# EAGLE design Drl_NEW (EAGLE 8.2.2)
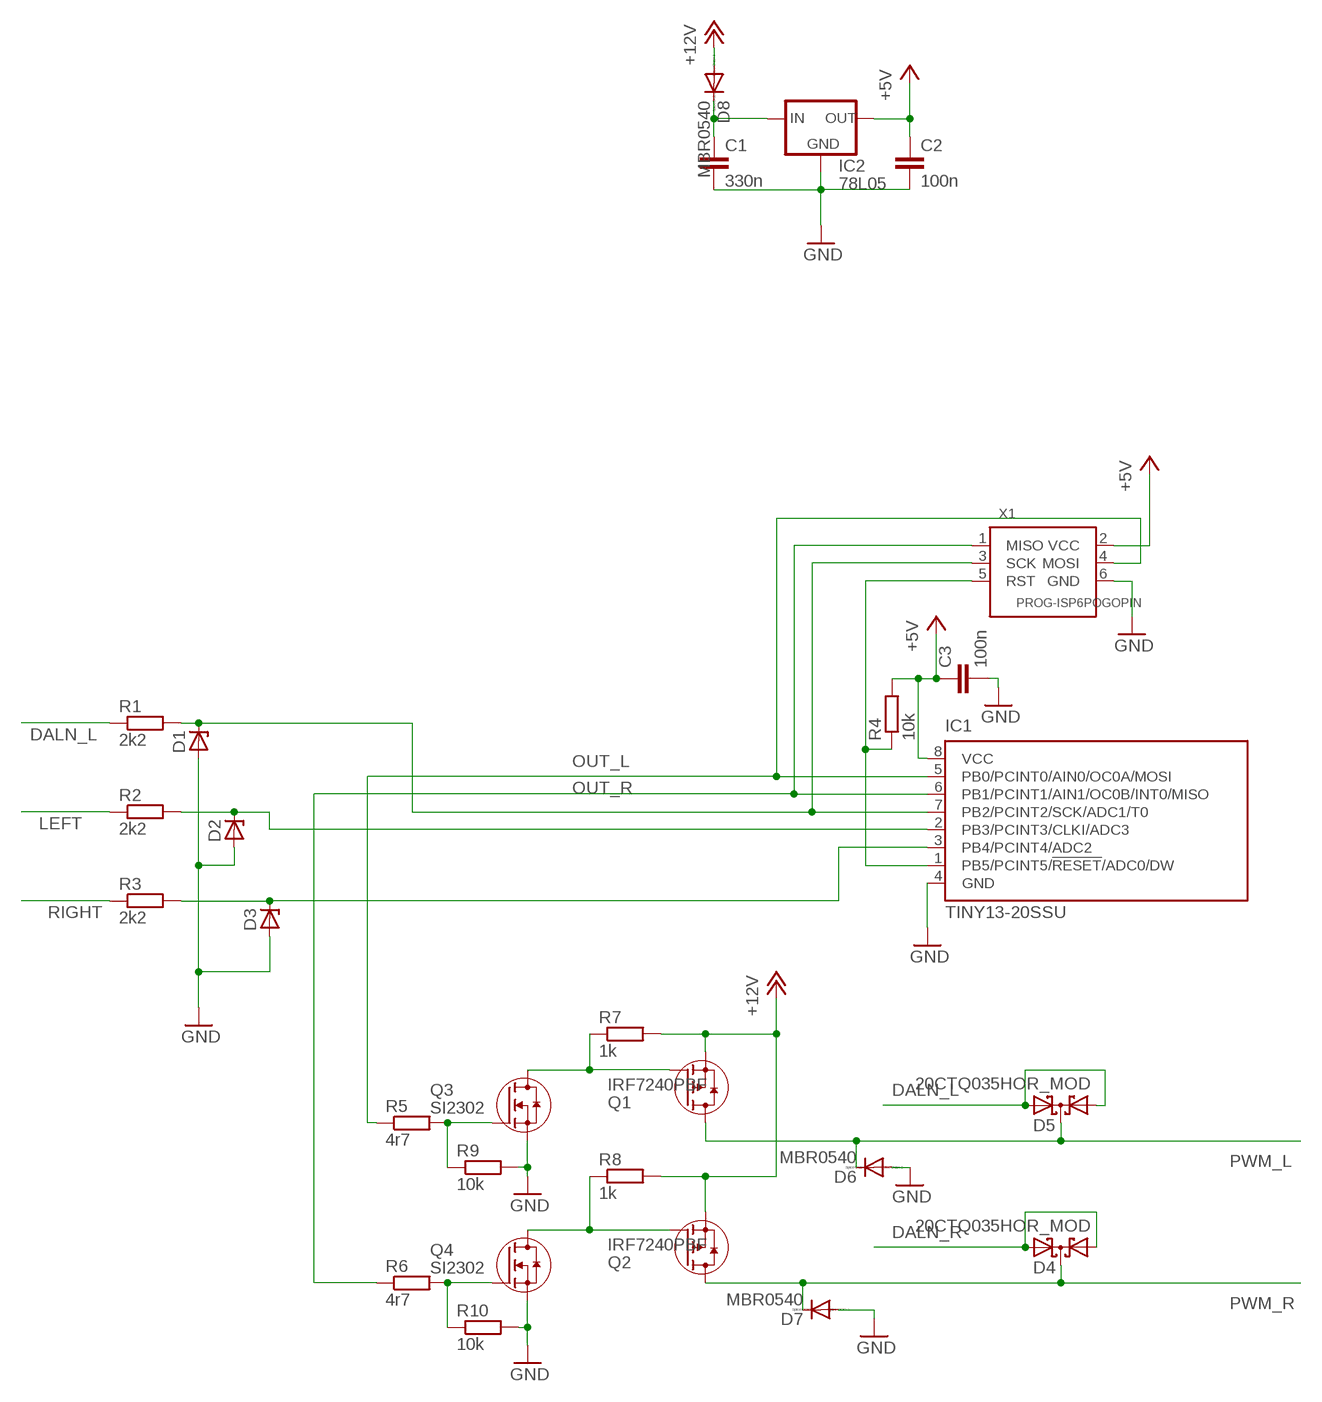
[diagram p0: schematic, sheet 1]

## Parts
C1  330n  C-EUC0805  [C0805]
C2  100n  C-EUC0805  [C0805]
C3  100n  C-EUC0805  [C0805]
D1  ZENER-DIODESOD80C  [SOD80C]
D2  ZENER-DIODESOD80C  [SOD80C]
D3  ZENER-DIODESOD80C  [SOD80C]
D4  20CTQ035HOR_MOD  [TO220AB_MOD]
D5  20CTQ035HOR_MOD  [TO220AB_MOD]
D6  MBR0540  CGRM4001-G  [SOD-123_MINI-SMA]
D7  MBR0540  CGRM4001-G  [SOD-123_MINI-SMA]
D8  MBR0540  CGRM4001-G  [SOD-123_MINI-SMA]
IC1  TINY13-20SSU  [8S1]
IC2  78L05  78LXXSOT89  [78LXX-SOT89]
Q1  IRF7240PBF  [SO08]
Q2  IRF7240PBF  [SO08]
Q3  SI2302  [SOT-23-GSD]
Q4  SI2302  [SOT-23-GSD]
R1  2k2  R-EU_R0603  [R0603]
R2  2k2  R-EU_R0603  [R0603]
R3  2k2  R-EU_R0603  [R0603]
R4  10k  R-EU_R0603  [R0603]
R5  4r7  R-EU_R0603  [R0603]
R6  4r7  R-EU_R0603  [R0603]
R7  1k  R-EU_R0603  [R0603]
R8  1k  R-EU_R0603  [R0603]
R9  10k  R-EU_R0603  [R0603]
R10  10k  R-EU_R0603  [R0603]
X1  PROG-ISP6POGOPIN  [PROG_POGOPIN]

## Nets
+5V: C2.1 C3.1 IC1.8(VCC) IC2.OUT R4.2 X1.2(VCC)
+12V: D8.A Q1.1(S) Q1.2(S) Q1.3(S) Q2.1(S) Q2.2(S) Q2.3(S) R7.2 R8.2
DALN_L: D5.A1 D5.A2 R1.1
DALN_R: D4.A1 D4.A2
GND: C1.2 C2.2 C3.2 D1.A D2.A D3.A D6.A D7.A IC1.4(GND) IC2.GND@0(GND) IC2.GND@1(GND) Q3.S Q4.S R9.2 R10.2 X1.6(GND)
LEFT: R2.1
N$2: D2.C IC1.2(PB3/PCINT3/CLKI/ADC3) R2.2
N$3: IC1.1(PB5/PCINT5/!RESET!/ADC0/DW) R4.1 X1.5(RST)
N$4: Q2.4(G) Q4.D R8.1
N$6: C1.1 D8.C IC2.IN
N$7: D3.C IC1.3(PB4/PCINT4/ADC2) R3.2
N$8: Q1.4(G) Q3.D R7.1
N$11: Q3.G R5.2 R9.1
N$12: Q4.G R6.2 R10.1
N$13: D1.C IC1.7(PB2/PCINT2/SCK/ADC1/T0) R1.2 X1.3(SCK)
OUT_L: IC1.5(PB0/PCINT0/AIN0/OC0A/MOSI) R5.1 X1.4(MOSI)
OUT_R: IC1.6(PB1/PCINT1/AIN1/OC0B/INT0/MISO) R6.1 X1.1(MISO)
PWM_L: D5.C D6.C Q1.5(D) Q1.6(D) Q1.7(D) Q1.8(D)
PWM_R: D4.C D7.C Q2.5(D) Q2.6(D) Q2.7(D) Q2.8(D)
RIGHT: R3.1

## Library data of the parts
C1-C3 = rcl:C-EU: CAPACITOR, European symbol
D1-D3 = diode:ZENER-DIODE: Z-Diode
D4 D5 = usb:20CTQ035: Schottky Dual Diode
D6-D8 = diode:CGRM400*-G: Molded plasitc,JEDEC SOD-123/Mini SMA Source: Comchip CGRM4001-G.pdf
IC1 = atmel:TINY13: 8-bit AVR Microcontroller with 1K Bytes In-System Programmable Flash Source: http://www.atmel.com/dyn/resources/prod_documents/2535S.pdf; MPN: ATTINY13-20SSU; OC_FARNELL: 1455133; OC_NEWARK: 58M3771
IC2 = usb:78LXX: VOLTAGE REGULATOR
Q1 Q2 = usb:IRF7240PBF
Q3 Q4 = usb:SI2302: N-канальный полевик
R1-R10 = rcl:R-EU_: RESISTOR, European symbol
X1 = usb:PROG-ISP

## Board
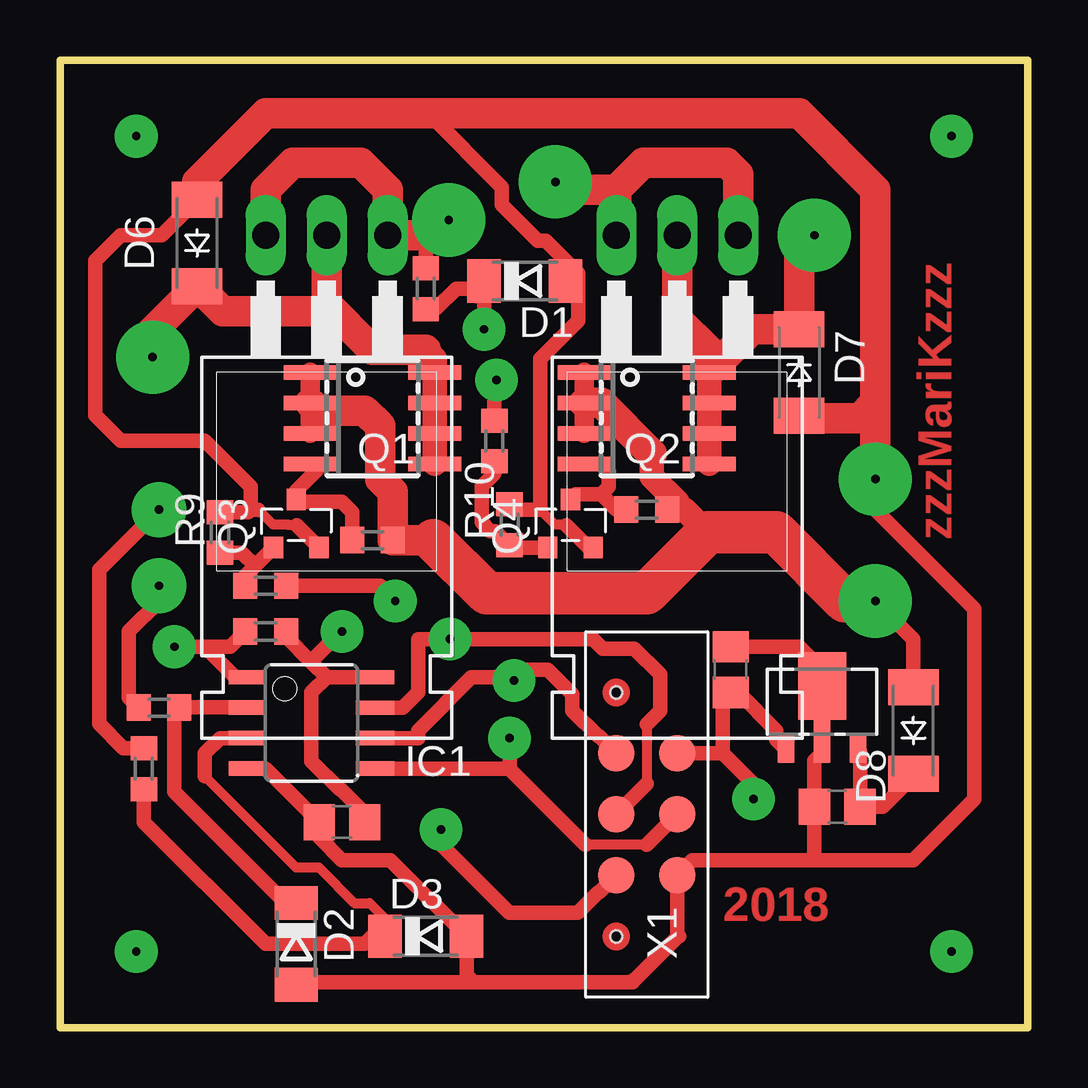
[diagram p1: board, top side]
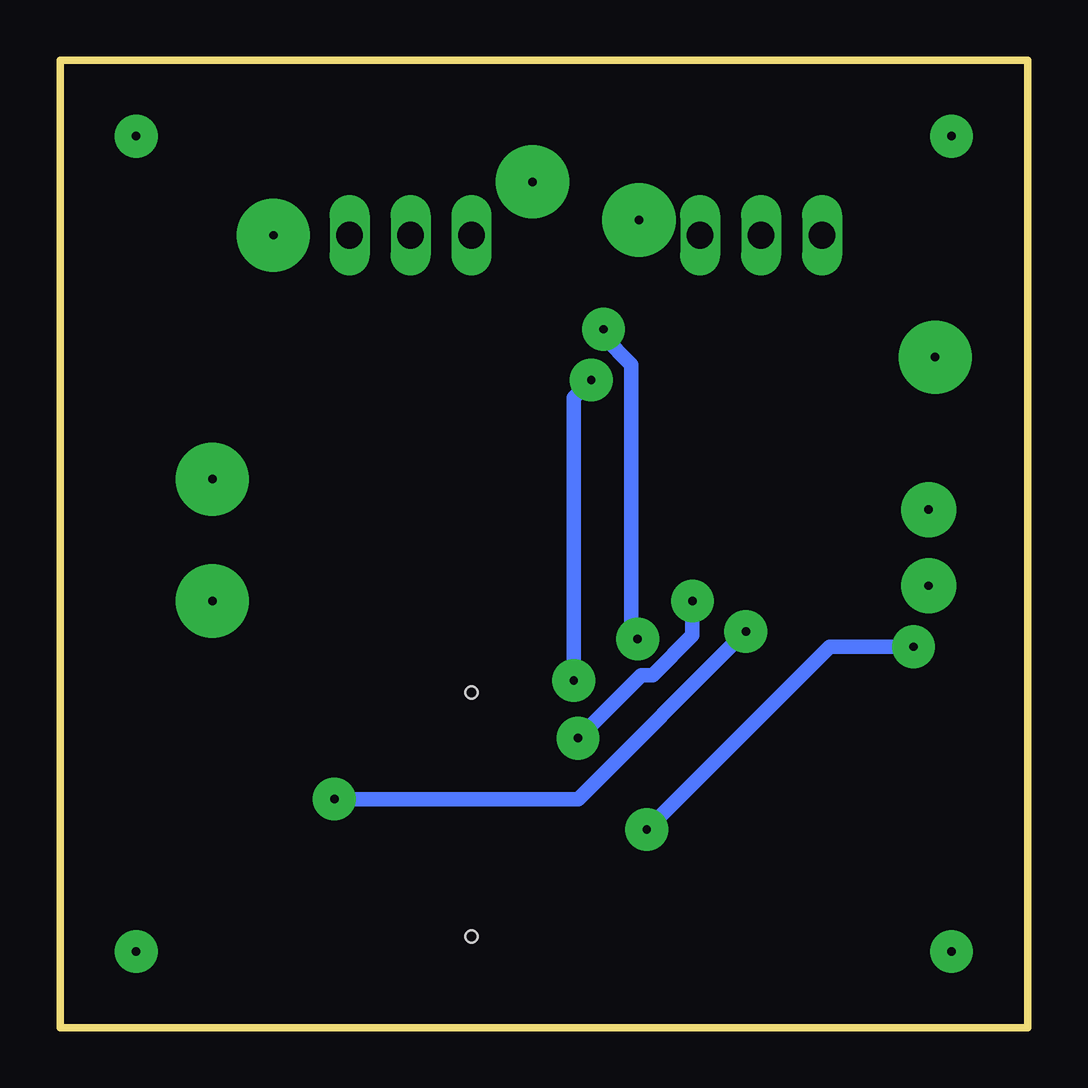
[diagram p2: board, bottom side, seen from below]

Size 40.32 x 40.32 mm. Coordinates in mm from the lower left corner, seen from the top.
Outline: 0,0 40.32,0 40.32,40.32 0,40.32 0,0
Copper layers (1*16): Top 0.035mm / dielectric 1.5mm / Bottom 0.035mm
Design rules "default *": minimum track width 16mil, minimum drill 0.35mm, track to track 12mil, track to pad 12mil, pad to pad 12mil, via to via 12mil, smd to smd 12mil, copper to edge 40mil, drill to drill 24mil, minimum pad ring 10mil, minimum via ring 8mil, stop-mask expansion 4mil, vias tented up to drill 0mil, thermal gap 10mil

### Footprints (pad centres in the part's own frame; a part is rotated, then mirrored left to right if it is on the bottom)
C0805 = smd 1.3 x 1.5: 1 -0.95,0; 2 0.95,0
SOD80C = smd 1.4 x 1.8: A 1.7,0; C -1.7,0
TO220AB_MOD = drill 1.118 long: A1 -2.54,-6.35; A2 2.54,-6.35; C 0,-6.35
SOD-123_MINI-SMA = smd 1.5 x 2.1: A 1.8,0; C -1.8,0
8S1 = smd 0.6 x 1.6: 1 -1.905,-2.654; 2 -0.645,-2.654; 3 0.625,-2.654; 4 1.895,-2.654; 5 1.905,2.654; 6 0.635,2.654; 7 -0.635,2.654; 8 -1.905,2.654
78LXX-SOT89 = smd 0.7 x 1.8: GND@0 0,-1.4 | smd 2 x 2.8: GND@1 0,0.9 | smd 0.7 x 1.1: IN 1.5,-1.75; OUT -1.5,-1.75
SO08 = smd 0.6 x 2.2: 1 -1.905,-2.6; 2 -0.635,-2.6; 3 0.635,-2.6; 4 1.905,-2.6; 5 1.905,2.6; 6 0.635,2.6; 7 -0.635,2.6; 8 -1.905,2.6
SOT-23-GSD = smd 0.8 x 0.9: D 0,2; G -0.95,0; S 0.95,0
R0603 = smd 1 x 1.1: 1 -0.85,0; 2 0.85,0
PROG_POGOPIN = smd 1.524 x 1.524: 1 0,7.62; 2 2.54,7.62; 3 0,5.08; 4 2.54,5.08; 5 0,2.54; 6 2.54,2.54 | hole 0.5: 0,0; 0,10.16

### Placement (x,y rotation side)
C1  32.38,9.21 180 top
C2  27.94,14.92 90 top
C3  11.75,8.57 180 top
D1  19.37,31.11 0 top
D2  9.84,3.49 270 top
D3  15.24,3.81 0 top
D4  25.72,26.67 180 top
D5  11.11,26.67 180 top
D6  5.71,32.7 90 top
D7  30.8,27.3 270 top
D8  35.56,12.38 90 top
IC1  10.48,12.7 270 top
IC2  31.75,13.34 0 top
Q1  13.02,25.4 270 top
Q2  24.45,25.4 270 top
Q3  9.84,20 0 top
Q4  21.27,20 0 top
R1  15.24,30.8 270 top
R2  4.13,13.34 0 top
R3  3.49,10.79 270 top
R4  8.57,16.51 0 top
R5  8.57,18.41 180 top
R6  18.1,24.45 270 top
R7  13.02,20.32 0 top
R8  24.45,21.59 0 top
R9  6.67,20.64 90 top
R10  18.73,20.95 90 top
X1  23.18,3.81 0 top

### Tracks (layer width: path | path; a pad name or v marks a point on that pad's centre or on a via)
+5V  (via drill 0.35 pad 1.78)
  Top 0.61: 11.11,14.61 IC1.8 | R4.2 9.42,16.3 10.46,15.26 | 10.46,15.26 11.11,14.61 | v28.89,9.53 28.89,10.16 27.62,11.43 | 27.62,11.43 X1.2 | v11.75,16.51 11.71,16.51 10.46,15.26 | C3.1 12.7,8.94 11.7,9.93 11.66,9.93 10.48,11.11 10.48,13.97 11.11,14.61 | IC2.OUT 29.84,11.99 29.84,12.38 28.25,13.97 C2.1 27.62,13.65 27.62,11.43
  Bottom 0.61: v28.89,9.53 18.73,9.53 v11.75,16.51
+12V  (via drill 0.35 pad 3.05)
  Top 0.61: v33.97,17.78 35.56,16.19 D8.A
  Top 0.813: Q2.1 Q2.2 Q2.3 | Q1.3 Q1.2 Q1.1
  Top 1.016: 24.66,23.91 24.66,22.96 25.72,21.91 25.61,21.91 R8.2 26.04,21.59 26.99,20.64
  Top 1.27: 24.66,23.91 22.54,26.04 Q2.2 | 15.56,20.32 R7.2 13.87,22.33 13.34,22.86 13.34,25.08 12.7,25.72 10.73,25.72 Q1.2
  Top 1.778: v33.97,17.78 32.7,17.78 29.84,20.64 26.99,20.64 24.45,18.1 17.78,18.1 15.56,20.32
DALN_L  (via drill 0.35 pad 3.05)
  Top 0.61: 13.65,33.09 D5.A1 | R1.1 15.24,32.7 15.56,33.02
  Top 1.27: D5.A2 8.57,34.92 9.69,36.04 12.54,36.04 13.65,34.92 13.65,33.09 | D5.A1 15.56,33.02 v16.2,33.66
DALN_R  (via drill 0.35 pad 3.05)
  Top 1.27: D4.A2 23.18,34.92 | 23.18,34.92 24.3,36.04 27.77,36.04 28.26,35.56 D4.A1 | 23.18,34.92 21.59,34.92 v20.64,35.24
GND  (via drill 0.35 pad 3.05)
  Top 0.406: 9.86,20.94 9.52,20.94 9.5,20.96 8.88,20.96 8.26,21.59 | 21.09,20.94 20.95,20.94 20.93,20.96 20.63,20.96 20,21.59
  Top 0.61: 23.93,1.98 23.89,1.98 23.81,1.91 | 25.72,3.89 X1.6 26.35,6.99 31.43,6.99 | 25.72,3.89 25.72,3.76 23.93,1.98 | 25.8,3.81 25.72,3.89 | 23.93,1.98 23.86,1.91 17.23,1.91 | 31.43,6.99 35.56,6.99 38.1,9.53 38.1,17.46 33.97,21.59 v33.97,22.86 | D3.A 16.94,2.2 17.23,1.91 | D3.A 16.94,4.33 | IC1.4 7.83,10.79 8.57,10.79 C3.2 10.8,7.93 11.75,6.99 13.77,6.99 D3.A | D2.A 9.96,1.91 17.23,1.91 | Q3.S 9.86,20.94 | 7.94,21.59 8.26,21.59 | 15.35,38.1 18.41,35.03 18.41,34.29 19.91,32.79 20.23,32.79 21.59,31.43 | 7.94,21.59 7.94,22.54 6.03,24.45 2.54,24.45 1.47,25.51 1.47,31.95 2.54,33.02 4.23,33.02 D6.A | 21.59,31.43 21.59,29.45 20,27.86 20,21.59 18.95,21.59 R10.2 | R9.2 7.83,21.49 7.94,21.59 | Q4.S 22.04,20 21.09,20.94 | D1.A 21.27,31.11 21.59,31.43 | 31.43,6.99 C1.2 31.43,11.12 31.75,11.43 IC2.GND@0 IC2.GND@1 31.75,14.92 30.8,15.87 C2.2
  Top 1.27: 33.97,26.04 33.34,25.4 30.9,25.4 D7.A | v33.97,22.86 33.97,26.04 | 33.97,26.04 33.97,34.92 30.8,38.1 15.35,38.1 8.57,38.1 5.71,35.24 D6.A
LEFT  (via drill 0.35 pad 2.29)
  Top 0.61: v4.13,18.41 4.13,17.78 2.86,16.51 2.86,13.76 R2.1
N$1  (via drill 0.35 pad 1.78)
  other vias: 3.17,37.15
N$2
  Top 0.61: IC1.2 5.41,13.35 5.4,13.34 R2.2 4.76,13.12 4.76,9.84 9.41,5.19 D2.C
N$3  (via drill 0.35 pad 1.78)
  Top 0.61: v4.76,15.88 6.03,15.88 | 6.03,15.88 7.3,14.61 IC1.1 | 6.03,15.88 7.09,15.88 R4.1 | X1.5 22.47,5.64 22.42,5.64 21.57,4.79 18.71,4.79 15.88,7.62 v15.88,8.26
  Bottom 0.61: v4.76,15.88 8.26,15.88 v15.88,8.26
N$4
  Top 0.61: R8.1 23.18,21.59 22.54,22.23 | 22.54,22.23 21.5,22.23 Q4.D | Q2.4 22.54,23.5 22.86,23.18 22.86,22.54 22.54,22.23
N$5  (via drill 0.35 pad 1.78)
  other vias: 37.15,37.15
N$6
  Top 0.61: D8.C 35.56,10.48 34.29,9.21 C1.1 33.34,11.5 IC2.IN
N$7
  Top 0.406: 6.03,10.48 9.84,6.67 10.79,6.67 12.27,5.19 12.9,5.19 13.65,4.45 13.65,3.92 D3.C
  Top 0.61: IC1.3 6.67,12.06 6.03,11.43 6.03,10.48 | D3.C 13.02,3.81 12.7,3.49 8.57,3.49 3.49,8.57 R3.2
N$8
  Top 0.61: Q1.4 10.69,23.22 9.84,22.37 Q3.D 9.94,21.91 11.75,21.91 12.17,21.49 R7.1
N$9  (via drill 0.35 pad 1.78)
  other vias: 37.15,3.17
N$10  (via drill 0.35 pad 1.78)
  other vias: 3.17,3.17
N$11
  Top 0.61: Q3.G 8.13,19.24 | R5.2 7.72,18.84 8.13,19.24 | R9.1 7.58,19.79 8.13,19.24
N$12
  Top 0.61: R6.2 18.1,23.08 17.57,22.56 17.57,21.05 17.93,20.7 18.14,20.7 R10.1 18.84,20 Q4.G
N$13  (via drill 0.35 pad 1.78)
  Top 0.406: 24.45,12.65 24.45,10.16
  Top 0.61: IC1.7 14.29,13.34 14.92,13.97 14.92,16.19 v16.25,16.19 22.23,16.19 22.62,15.8 23.93,15.8 25.01,14.73 25.01,13.21 24.45,12.65 | 24.45,10.16 X1.3 | D1.C 17.35,30.48 | D1.C v17.67,29.11 v17.67,29.1 | R1.2 15.66,29.95 16.51,30.8 17.35,30.8 D1.C
  Bottom 0.61: v17.67,29.1 17.67,28.79 16.51,27.62 16.51,16.45 v16.25,16.19
OUT_L  (via drill 0.35 pad 1.78)
  Top 0.406: 24.45,7.62 21.91,7.62
  Top 0.61: X1.4 24.45,7.62 | 18.71,10.79 IC1.5 | R5.1 13.34,18.41 v13.97,17.78 | v18.73,12.06 18.73,10.81 18.71,10.79 | 21.91,7.62 21.89,7.62 18.71,10.79
  Bottom 0.61: v18.73,12.06 16.1,14.69 15.63,14.69 13.97,16.36 v13.97,17.78
OUT_R  (via drill 0.35 pad 1.78)
  Top 0.61: IC1.6 14.92,12.06 14.92,12.38 17.14,14.61 18.78,14.61 v18.92,14.47 19.37,14.92 20.32,14.92 21.35,13.89 21.35,13.21 22.42,12.14 22.47,12.14 X1.1 | R6.1 18.1,26.9 v18.19,26.99
  Bottom 0.61: v18.92,14.47 18.92,26.26 v18.19,26.99
PWM_L  (via drill 0.35 pad 3.05)
  Top 1.016: 15.24,28.26 15.62,27.88 Q1.8 Q1.7 Q1.5 Q1.6
  Top 1.27: 11.11,30.16 D5.C | 11.11,30.16 13.02,28.26 15.24,28.26 | 11.11,30.16 10.79,29.84 6.77,29.84 D6.C 3.86,29.05 v3.86,27.94
PWM_R  (via drill 0.35 pad 3.05)
  Top 1.016: Q2.8 Q2.7 Q2.6 Q2.5
  Top 1.27: 30.8,29.21 D7.C | D7.C 30.8,32.38 v31.43,33.02 | D4.C 25.72,29.53 27.05,28.2 Q2.8 28.85,29.11 D7.C
RIGHT  (via drill 0.35 pad 2.29)
  Top 0.61: v4.13,21.59 1.63,19.09 1.63,12.66 2.64,11.64 R3.1

### Text on the board
Top: zzzMariKzzz | 2018
tDocu: In_DR | In_DL | Out_DR | Out_DL | GND | R | +12V | L